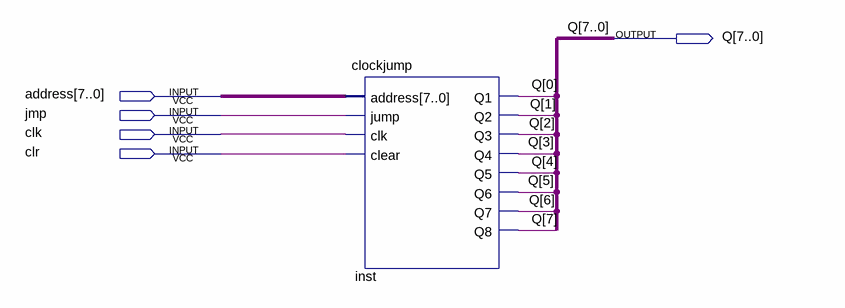
[diagram p0: schematic sheet]
// Quartus schematic counter_jump_bus.bdf as structural Verilog: 1 symbols, 5 pins
module counter_jump_bus (
  input  [7:0] address,
  input  jmp,
  input  clk,
  input  clr,
  output [7:0] Q
);

  clockjump inst (
    .address(address), .jump(jmp), .clk(clk), .clear(clr), .Q1(Q[0]), .Q2(Q[1]), .Q3(Q[2]), .Q4(Q[3]),
    .Q5(Q[4]), .Q6(Q[5]), .Q7(Q[6]), .Q8(Q[7]));
endmodule
